# Altium schematic sheet Блок6.SchDoc
size A4; DocumentNumber: 11; SheetNumber: 11; SheetTotal: 12
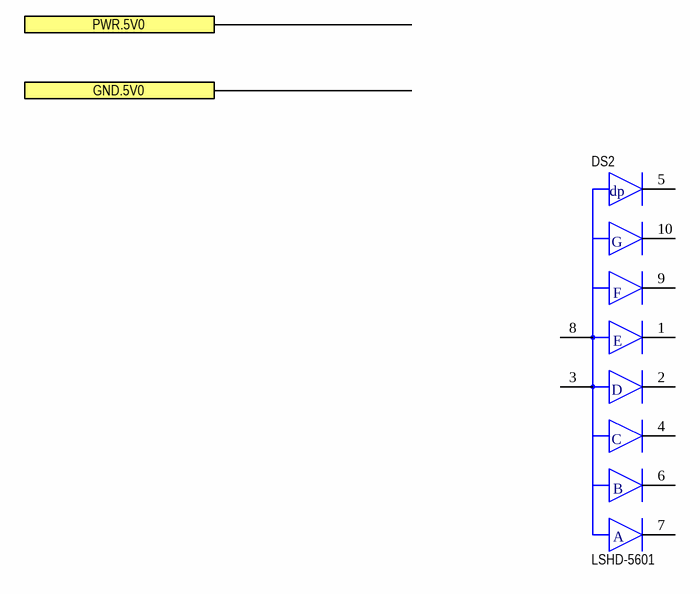
[diagram p0: Блок6.SchDoc]

## Parts
DS2  LSHD-5601  [FP-LSHD-5601-MFG]

## Ports
GND.5V0, PWR.5V0

## Nets

Not connected (* = marked no-connect by the designer): DS2 1(CATHODE_E) 2(CATHODE_D) 3(COMMON_ANODE) 4(CATHODE_C) 5(CATHODE_DP) 6(CATHODE_B) 7(CATHODE_A) 8(COMMON_ANODE) 9(CATHODE_F) 10(CATHODE_G)

## Notes on the sheet
- (in symbol CMP-22013-000002-1) dp; G; F; E; D; C; B; A

## Library data of the parts
DS2 = CMP-22013-000002-1: LED 7-SEG .56" GREEN 565NM CA; Manufacturer: Lite-On; Wavelength: 569nm; Luminous Intensity: 2.4mcd; Forward Current: 20mA; Forward Voltage: 2.1V; Element Config: Common Anode; Reverse Voltage: 5V; Device Class L1: Optoelectronics; ComponentLink2URL: https://media.digikey.com/pdf/Data%20Sheets/Lite-On%20PDFs/LSHD-5601.pdf; Temperature Range High: +105°C; ComponentLink2Description: Datasheet; Automotive: No; Temperature: -35°C to +105°C; Mouser Description: LED Displays & Accessories Green, Low Current 0.56, CARHD; Package: LSHD-5601; Device Class L3: LED Displays; Height: 8.25mm; Digikey Description: LED 7-SEG .56" GREEN 565NM CA; Category: Disp; Display Type: LED; Octopart: https://octopart.com/lshd-5601-lite-on-548440; Lead Free: Yes; Temperature Range Low: -35°C; RoHS: TRUE; Test Current: 20mA; Manufacturer Part Number: LSHD-5601; Device Class L2: Displays